# Altium project ThermoFlagger.PrjPcb
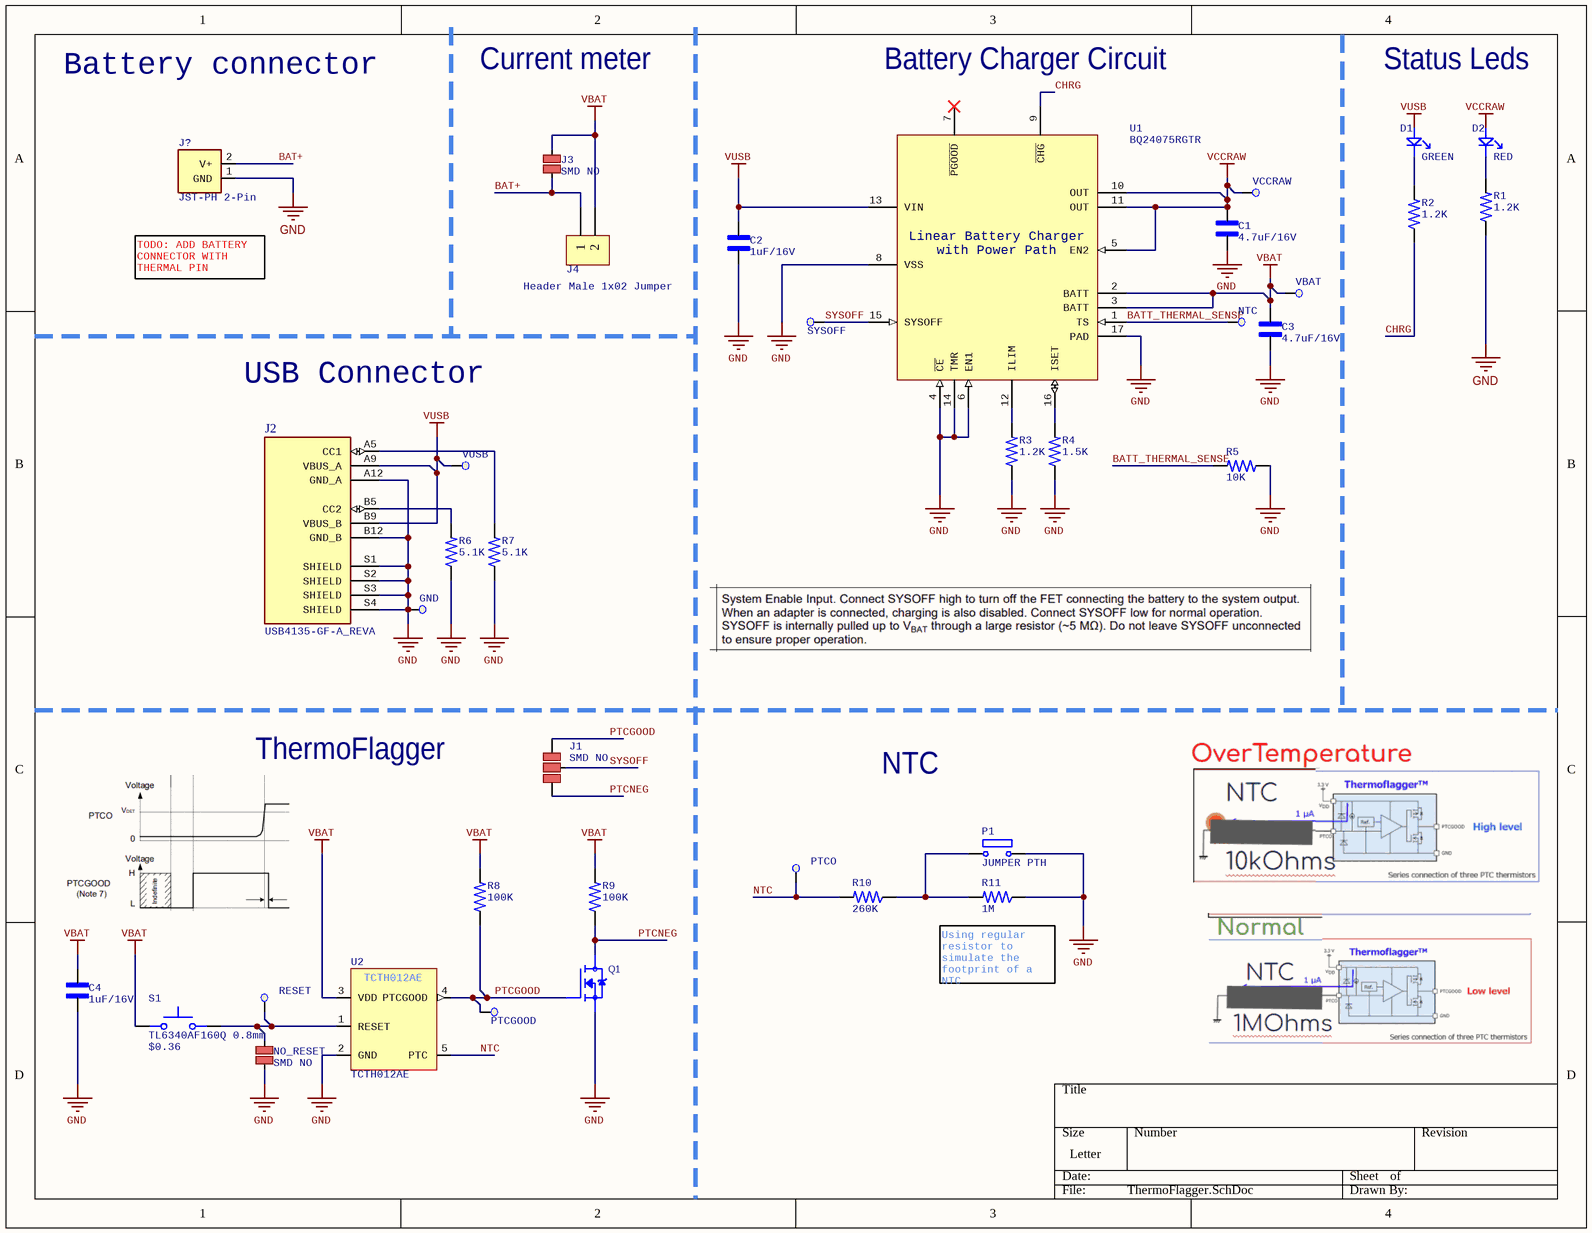
[diagram p0: ThermoFlagger.SchDoc]
1 sheet, 37 parts. Net scope: global (net labels, ports and power ports of the same name join across sheets).
Board file: ThermoFlagger.PcbDoc

## Sheet ThermoFlagger.SchDoc
size Letter; SheetNumber: 1; SheetTotal: 1

### Parts
C1  4.7uF/16V  [C0603]
C2  1uF/16V  [C0603]
C3  4.7uF/16V  [C0603]
C4  1uF/16V  [C0603]
D1  GREEN  [LED 0603]
D2  RED  [LED 0603]
GND  Test point 1.2mm  [TEST_POINT_1.2MM]  (value not drawn)  (no BOM)
J1  SMD NO  [JUMPER_SMD_NO_2WAY]  (net tie, no BOM)
J2  USB4135-GF-A_REVA  [GCT_USB4135 16-pin]
J3  SMD NO  [JUMPER_SMD_NO]  (net tie, no BOM)
J4  Header Male 1x02 Jumper  [Header 1x02 Jumper]
J?  JST-PH 2-Pin  [JST_B2B-PH-K-S(LF)(SN)]
NO_RESET  SMD NO  [JUMPER_SMD_NO]  (net tie, no BOM)
NTC  Test point 1.2mm  [TEST_POINT_1.2MM]  (value not drawn)  (no BOM)
P1  JUMPER PTH  [HDR1X2]  (no BOM)
PTCGOOD  Test point 1.2mm  [TEST_POINT_1.2MM]  (value not drawn)  (no BOM)
PTCO  Test point 1.2mm  [TEST_POINT_1.2MM]  (value not drawn)  (no BOM)
Q1  0.19A/1.1V  [SOT-23-3]  (value not drawn)
R1  1.2K  [R0603]
R2  1.2K  [R0603]
R3  1.2K  [R0603]
R4  1.5K  [R0603]
R5  10K  [R0603]
R6  5.1K  [R0603]
R7  5.1K  [R0603]
R8  100K  [R0603]
R9  100K  [R0603]
R10  260K  [R0603]
R11  1M  [R0603]
RESET  Test point 1.2mm  [TEST_POINT_1.2MM]  (value not drawn)  (no BOM)
S1  TL6340AF160Q 0.8mm  Parameter 1: $0.36  [TL6340AF160Q]
SYSOFF  Test point 1.2mm  [TEST_POINT_1.2MM]  (value not drawn)  (no BOM)
U1  BQ24075RGTR  [VQFN16]
U2  TCTH012AE  [SOT-553 (ESV)]
VBAT  Test point 1.2mm  [TEST_POINT_1.2MM]  (value not drawn)  (no BOM)
VCCRAW  Test point 1.2mm  [TEST_POINT_1.2MM]  (value not drawn)  (no BOM)
VUSB  Test point 1.2mm  [TEST_POINT_1.2MM]  (value not drawn)  (no BOM)

### Nets
GND: C1.2 C2.2 C3.2 C4.2 GND.1 J2.A12(GND_A) J2.B12(GND_B) J2.S1(SHIELD) J2.S2(SHIELD) J2.S3(SHIELD) J2.S4(SHIELD) J?.1(GND) NO_RESET.1 P1.2 Q1.2(S) R1.1 R3.1 R4.1 R5.1 R6.1 R7.1 R11.1 U1.4(~{CE}) U1.6(EN1) U1.8(VSS) U1.14(TMR) U1.17(PAD) U2.2(GND)
VBAT: C3.1 C4.1 J3.1 J4.2 R8.2 R9.2 S1.1 U1.2(BATT) U1.3(BATT) U2.3(VDD) VBAT.1
VCCRAW: C1.1 D2.1(A) U1.5(EN2) U1.10(OUT) U1.11(OUT) VCCRAW.1
VUSB: C2.1 D1.1(A) J2.A9(VBUS_A) J2.B9(VBUS_B) U1.13(VIN) VUSB.1
BAT+: J3.2 J4.1 J?.2(V+)
BATT_THERMAL_SENSE: NTC.1 R5.2 U1.1(TS)
CHRG: R2.1 U1.9(~{CHG})
NTC: PTCO.1 R10.2 U2.5(PTC)
PTCGOOD: J1.3 PTCGOOD.1 Q1.1(G) R8.1 U2.4(PTCGOOD)
PTCNEG: J1.1 Q1.3(D) R9.1
SYSOFF: J1.2 SYSOFF.1 U1.15(SYSOFF)
NetD1_2: D1.2(K) R2.2
NetD2_2: D2.2(K) R1.2
NetJ2_A5: J2.A5(CC1) R7.2
NetJ2_B5: J2.B5(CC2) R6.2
NetNO_RESET_2: NO_RESET.2 RESET.1 S1.2 U2.1(RESET)
NetP1_1: P1.1 R10.1 R11.2
NetR3_2: R3.2 U1.12(ILIM)
NetR4_2: R4.2 U1.16(ISET)

Not connected (* = marked no-connect by the designer): U1 7(~{PGOOD})*

### Notes on the sheet
- Battery connector
- Current meter
- Battery Charger Circuit
- Status Leds
- TODO: ADD BATTERY CONNECTOR WITH THERMAL PIN
- USB Connector
- ThermoFlagger
- NTC
- (near R11) Using regular resistor to simulate the footprint of a NTC
- (in symbol BQ24075RGTR) Linear Battery Charger; with Power Path

### Library data of the parts
C1 C3 = C0603 4.7uF/16V: 0603 4.7 uF 16 V ±10% Tolerance X5R Multilayer Ceramic Capacitor; Manufacturer: Murata; Manufacturer Part Number: GRT188R61C475KE13D; Value: 4.7uF; Voltage Rating: 16V; Supplier 1: Mouser; Supplier Part Number 1: 81-GRT188R61C475KE3D; RoHS: Yes; Category: Ceramic Capacitors; Stock 1: 39950; Pricing 1: 1=0.16, 10=0.066, 50=0.066, 100=0.038, 1000=0.034, 10000=0.029 (USD); Mounting Technology: Surface Mount; Case/Package: 0603; Case Code (Metric): 1608; Case Code (Imperial): 0603; Min Operating Temperature: -55°C; Max Operating Temperature: 85°C; Packaging: Cut Tape; Tolerance: 10%; Series: GRT; Length: 0.063inch; Width: 0.031inch; Thickness: 0.035inch; Ratings: AEC-Q200; RoHS Compliant: Yes
C2 C4 = C0603 1uF/16V X5R: MLCC 1uF 16V X5R 10% SMD 0603 85C Paper T/R; Manufacturer: Yageo; Manufacturer Part Number: CC0603KRX5R7BB105; Dissipation Factor: 7%; Supplier 1: Mouser; Supplier Part Number 1: 603-CC603KRX5R7BB105; RoHS: Yes; Category: Ceramic Capacitors; Stock 1: 726921; Pricing 1: 1=0.17000, 10=0.09100, 50=0.09100, 100=0.04100, 1000=0.03400, 10000=0.02100 (USD); Mount: Surface Mount; Case/Package: 0603; Number of Pins: 2; Case Code (Imperial): 0603; Case Code (Metric): 1608; Min Operating Temperature: -55°C; Max Operating Temperature: 85°C; Capacitance: 1uF; Tolerance: 10%; Dielectric: X5R; Voltage Rating: 16V; Voltage Rating (DC): 16V; Packaging: Tape and Reel; Package Quantity: 4000; Termination: SMD/SMT; Resistor Type: Ceramic; Series: CC; Construction: Flat; Length: 1.6mm; Width: 0.8mm; Height: 0.8mm; Thickness: 0.035inch; Depth: 0.8mm; Radiation Hardening: No; REACH SVHC: Unknown; Lead Free: Lead Free; Halogen Free: Halogen Free; RoHS Compliant: Yes
D1 = LED 0603 GREEN: Green 575nm LED Indication - Discrete 2V 0603; Manufacturer: Wurth Electronics; Manufacturer Part Number: 150060VS55040; Luminous Intensity: 60mcd; Lens Style: Flat; Viewing Angle: 140°; Dominant Wavelength: 573nm; Test Current: 20mA; Lens Transparency: Diffused; Lens Size: 0.8mm; Supplier 1: Mouser; Supplier Part Number 1: 710-150060VS55040; RoHS: No; Category: LEDs; Stock 1: 24940; Pricing 1: 1=0,18000, 10=0,16200, 50=0,16200, 100=0,14700, 1000=0,11700, 10000=0,11700 (USD); Mount: Surface Mount; Case/Package: 0603; Color: Green; Forward Voltage: 2V; Packaging: Cut Tape; Height: 0.5mm; Case Code (Imperial): 0603; Case Code (Metric): 1608; Length: 1.6mm; Width: 0.8mm
D2 = LED 0603 RED: Red 625nm LED Indication - Discrete 2V 0603; Manufacturer: Wurth Electronics; Manufacturer Part Number: 150060RS55040; Luminous Intensity: 90mcd; Viewing Angle: 140°; Lens Style: Flat; Dominant Wavelength: 624nm; Test Current: 20mA; Lens Transparency: Diffused; Lens Size: 0.8mm; Supplier 1: Mouser; Supplier Part Number 1: 710-150060RS55040; RoHS: No; Category: LEDs; Stock 1: 8586; Pricing 1: 1=0.18000, 10=0.16200, 100=0.14700, 500=0.13200, 1000=0.11700, 2000=0.11700 (USD); Mount: Surface Mount; Case/Package: 0603; Color: Red; Forward Voltage: 2V; Height: 0.5mm; Case Code (Imperial): 0603; Case Code (Metric): 1608; Packaging: Tape and Reel; Length: 1.6mm; Width: 0.8mm
GND NTC PTCGOOD PTCO RESET SYSOFF VBAT VCCRAW VUSB = Test point: SMD test point
J1 = JUMPER_SMD_NO_2WAY
J2 = USB4135-GF-A_REVA: Usb C Rec Gf Ra 6P SMT & SMT She; Manufacturer 1: Global Connector Technology; Supplier 1: Mouser; Supplier Part Number 1: 640-USB4135-GF-A; Manufacturer Part Number 1: USB4135-GF-A; RoHS: No; Category: Connectors; Stock 1: 1196; Pricing 1: 1=0.67300, 50=0.59700, 100=0.56000, 250=0.52200, 500=0.46600, 1000=0.43300, 1500=0.40000, 3000=0.33600 (USD)
J3 NO_RESET = JUMPER_SMD_NO: Rule: UNIONINDEX=0|RULEKIND=ShortCircuit|NETSCOPE=AnyNet|LAYERKIND=SameLayer|NAME=Schematic Short-Circuit Constraint|ALLOWED=TRUE|UNIT=Imperial
J4 = Header Male Jumper 1x02
J? = JST-PH 2-Pin: JST (JAPAN SOLDERLESS TERMINALS) - B2B-PH-K-S(LF)(SN) - Pin Header, Top Entry, Wire-to-Board, 2 mm, 1 Rows, 2 Contacts, Through Hole, PH Series; Supplier 1: LCSC; Supplier Part Number 1: C131337; Manufacturer: JST; Manufacturer Part Number: B2B-PH-K-S(LF)(SN); RoHS: Yes; Category: Connectors; Stock 1: 3352380; Pricing 1: 20=0.03960, 200=0.03310, 600=0.02840, 2000=0.02160, 10000=0.02100, 20000=0.02070 (USD); Weight: 0.0625lb; Length: 0.2inch; Width: 0.24inch; Height: 0.35inch
P1 = JUMPER PTH NO
Q1 = MOSFET N-CH NX7002AK,215: MOSFET Transistor, N Channel, 190 mA, 60 V, 3 ohm, 10 V, 1.6 V; Manufacturer: Nexperia; Supplier 1: Mouser; Supplier Part Number 1: 771-NX7002AK,215; Manufacturer Part Number: NX7002AK,215; RoHS: Yes; Category: MOSFETs; Stock 1: 451760; Pricing 1: 1=0.18, 10=0.131, 50=0.131, 100=0.059, 1000=0.036, 10000=0.021 (USD); RoHS Compliant: Yes; Supplier 2: LCSC; Supplier Part Number 2: C255584
R1-R3 = R0603 1.2K: RES 0603 1.2K OHM 1% 1/10W; Manufacturer: Yageo; Manufacturer Part Number: RC0603FR-071K2L; Power Rating: 100mW; Voltage Rating: 50V; Resistance: 1.2kR; Temperature Coefficient: 100ppm/°C; Supplier 1: Mouser; Supplier Part Number 1: 603-RC0603FR-071K2L; RoHS: Yes; Category: Chip SMD Resistors; Stock 1: 27884; Pricing 1: 1=0.10000, 10=0.02400, 50=0.02400, 100=0.01000, 1000=0.00400, 10000=0.00300 (USD); Case/Package: 0603; Number of Pins: 2; Case Code (Imperial): 0603; Case Code (Metric): 1608; Size Code: 0603; Min Operating Temperature: -55°C; Max Operating Temperature: 155°C; Tolerance: 1%; Voltage Rating (DC): 50V; Packaging: Tape and Reel; Termination: SMD/SMT; Resistor Type: Thick Film; Features: Moisture Resistant; Series: RC; Max Power Dissipation: 100mW; Number of Terminations: 2; Construction: Rectangular; Resistance Tolerance: 1%; Length: 1.6mm; Width: 0.8mm; Height: 0.45mm; Depth: 0.8mm; REACH SVHC: No SVHC; Military Standard: Not; Lead Free: Lead Free; RoHS Compliant: Yes; ComponentLink1URL: http://www.farnell.com/datasheets/443971.pdf?src-supplier=Farnell; ComponentLink1Description: http://www.farnell.com/datasheets/443971.pdf?src-supplier=Farnell; ComponentLink2URL: http://www.farnell.com/datasheets/1868787.pdf?src-supplier=Farnell; ComponentLink2Description: http://www.farnell.com/datasheets/1868787.pdf?src-supplier=Farnell; ComponentLink3URL: http://www.farnell.com/datasheets/2167052.pdf?src-supplier=Farnell; ComponentLink3Description: http://www.farnell.com/datasheets/2167052.pdf?src-supplier=Farnell; ComponentLink4URL: http://www.mouser.com/ds/2/447/RC0603-272842.pdf?src-supplier=Mouser; ComponentLink4Description: http://www.mouser.com/ds/2/447/RC0603-272842.pdf?src-supplier=Mouser; ComponentLink5URL: http://components.arrow.com/part/dataview/0323_00047720?src-supplier=Arrow+Europe; ComponentLink5Description: http://components.arrow.com/part/dataview/0323_00047720?src-supplier=Arrow+Europe; ComponentLink6URL: http://www.farnell.com/datasheets/443971.pdf?src-supplier=Element14; ComponentLink6Description: http://www.farnell.com/datasheets/443971.pdf?src-supplier=Element14; ComponentLink7URL: http://www.farnell.com/datasheets/2167052.pdf?src-supplier=Newark; ComponentLink7Description: http://www.farnell.com/datasheets/2167052.pdf?src-supplier=Newark; ComponentLink8URL: http://www.farnell.com/datasheets/1868787.pdf?src-supplier=Element14; ComponentLink8Description: http://www.farnell.com/datasheets/1868787.pdf?src-supplier=Element14; ComponentLink9URL: http://www.farnell.com/datasheets/2167052.pdf?src-supplier=Element14; ComponentLink9Description: http://www.farnell.com/datasheets/2167052.pdf?src-supplier=Element14; ComponentLink10URL: http://www.yageo.com/documents/recent/PYu-RC0603_51_RoHS_L_7.pdf?src-supplier=Future+Electronics; ComponentLink10Description: http://www.yageo.com/documents/recent/PYu-RC0603_51_RoHS_L_7.pdf?src-supplier=Future+Electronics; ComponentLink11URL: https://www.verical.com/server-webapp/html/getDatasheet?partID=326670&src-supplier=Verical; ComponentLink11Description: https://www.verical.com/server-webapp/html/getDatasheet?partID=326670&src-supplier=Verical; ComponentLink12URL: http://www.farnell.com/datasheets/1868787.pdf?src-supplier=Newark; ComponentLink12Description: http://www.farnell.com/datasheets/1868787.pdf?src-supplier=Newark; ComponentLink13URL: http://www.yageo.com/documents/recent/PYu-RC_Group_51_RoHS_L_9.pdf?src-supplier=Digi-Key; ComponentLink13Description: http://www.yageo.com/documents/recent/PYu-RC_Group_51_RoHS_L_9.pdf?src-supplier=Digi-Key; ComponentLink14URL: http://www.yageo.com/documents/recent/PYu-RC_Group_51_RoHS_L_10.pdf?src-supplier=Digi-Key; ComponentLink14Description: http://www.yageo.com/documents/recent/PYu-RC_Group_51_RoHS_L_10.pdf?src-supplier=Digi-Key
R4 = R0603 1.5K: RES 0603 1.5K OHM 0.5% 1/10W; Manufacturer: Yageo; Manufacturer Part Number: RC0603FR-071K5L; Tolerance: 1%; Resistance: 1.5kR; Temperature Coefficient: 100ppm/°C; Voltage Rating (DC): 50V; Power Rating: 100mW; Supplier 1: Mouser; Supplier Part Number 1: 603-RC0603FR-071K5L; RoHS: Yes; Category: Chip SMD Resistors; Stock 1: 312486; Pricing 1: 1=0.10000, 10=0.01800, 50=0.01800, 100=0.00600, 1000=0.00500, 10000=0.00300 (USD); Case/Package: 0603; Number of Pins: 2; Case Code (Metric): 1608; Case Code (Imperial): 0603; Min Operating Temperature: -55°C; Max Operating Temperature: 155°C; Packaging: Tape and Reel; Resistor Type: Thick Film; Voltage Rating: 50V; Package Quantity: 1; Number of Terminations: 2; Termination: SMD/SMT; Max Power Dissipation: 100mW; Features: Moisture Resistant; Length: 0.063inch; Width: 0.031inch; Height: 0.022inch; Depth: 0.8mm; REACH SVHC: No SVHC; Lead Free: Lead Free; Military Standard: Not
R5 = R0603 10K: SMD Chip Resistor, 10 kOhm, ± 1%, 100 mW, 0603 [1608 Metric], Thick Film, Anti-Sulfur; Manufacturer 1: Yageo; Manufacturer Part Number 1: AF0603FR-0710KL; Temperature Coefficient: 100ppm/°C; Power Rating: 100mW; Voltage Rating: 50V; Value: 10kR; Supplier 1: Mouser; Supplier Part Number 1: 603-AF0603FR-0710KL; RoHS: Yes; Category: Chip SMD Resistors; Case/Package: 0603; Case Code (Metric): 1608; Case Code (Imperial): 0603; Min Operating Temperature: -55°C; Max Operating Temperature: 155°C; Tolerance: 1%; Packaging: Tape and Reel; Package Quantity: 1; Number of Terminations: 2; Termination: SMD/SMT; Max Power Dissipation: 100mW; Features: Moisture Resistant,Anti-Sulfur; Length: 0.063inch; Width: 0.031inch; Height: 0.022inch; Lead Free: 5697LeadFree; Stock 3: 5000; Pricing 3: 5000=0.00223, 10000=0.00219, 20000=0.00213 (USD); Series: AF; RoHS Compliant: Yes; Supplier 2: Mouser; Supplier Part Number 2: 667-ERJ-3EKF1002V
R6 R7 = R0603 5.1K: RES 0603 5.1K OHM 1% 1/10W; Manufacturer: Yageo; Manufacturer Part Number: RC0603FR-075K1L; Power Rating: 100mW; Temperature Coefficient: 100ppm/°C; Resistance: 5.1kR; Voltage Rating: 50V; Supplier 1: Mouser; Supplier Part Number 1: 603-RC0603FR-075K1L; RoHS: Yes; Category: Chip SMD Resistors; Stock 1: 557916; Case/Package: 0603; Number of Pins: 2; Case Code (Imperial): 0603; Case Code (Metric): 1608; Min Operating Temperature: -55°C; Max Operating Temperature: 155°C; Tolerance: 1%; Packaging: Tape and Reel; Package Quantity: 1; Termination: SMD/SMT; Resistor Type: Thick Film; Number of Terminations: 2; Max Power Dissipation: 100mW; Voltage Rating (DC): 50V; Features: Moisture Resistant; Length: 0.063inch; Width: 0.031inch; Height: 0.022inch; Depth: 0.8mm; REACH SVHC: No SVHC; Military Standard: Not; Lead Free: Lead Free
R8 R9 = R0603 100K: RES 0603 100K OHM 1% 1/10W; Manufacturer 1: Yageo; Manufacturer Part Number 1: RC0603FR-07100KL; Power Rating: 100mW; Voltage Rating: 50V; Resistance: 100kR; Temperature Coefficient: 100ppm/°C; Working Voltage: 75V; Supplier 1: Mouser; Supplier Part Number 1: 603-RC0603FR-07100KL; RoHS: Yes; Category: Chip SMD Resistors; Stock 1: 4536807; Pricing 1: 1=0.10000, 10=0.02100, 100=0.00900, 1000=0.00400, 5000=0.00300, 10000=0.00200 (USD); Case/Package: 0603; Number of Pins: 2; Case Code (Imperial): 0603; Case Code (Metric): 1608; Min Operating Temperature: -55°C; Max Operating Temperature: 155°C; Tolerance: 1%; Voltage Rating (DC): 50V; Packaging: Tape and Reel; Termination: SMD/SMT; Resistor Type: Thick Film; Number of Terminations: 2; Length: 1.6mm; Width: 0.8mm; Height: 0.45mm; Depth: 0.8mm; REACH SVHC: No SVHC; Military Standard: Not; Lead Free: Lead Free
R10 = R0603 215K: RES 0603 215K OHM 1% 1/10W; Manufacturer 1: Yageo; Manufacturer Part Number 1: RC0603FR-07215KL; Power Rating: 100mW; Voltage Rating: 75V; Voltage Rating (DC): 50V; Resistance: 215kR; Temperature Coefficient: 100ppm/°C; Supplier 1: Mouser; Supplier Part Number 1: 603-RC0603FR-07215KL; RoHS: Yes; Category: Chip SMD Resistors; Stock 1: 61268; Pricing 1: 1=0,10000, 10=0,01800, 50=0,01800, 100=0,00700, 1000=0,00400, 10000=0,00200 (USD); Case/Package: 0603; Case Code (Imperial): 0603; Case Code (Metric): 1608; Min Operating Temperature: -55°C; Max Operating Temperature: 155°C; Tolerance: 1%; Packaging: Tape and Reel; Termination: SMD/SMT; Resistor Type: Thick Film; Number of Terminations: 2; Length: 1.6mm; Width: 0.031inch; Height: 0.022inch; Depth: 0.8mm; Military Standard: Not; Lead Free: Lead Free; Weight: 7.1E-05oz; Size Code: 0603; Series: RC; Package Quantity: 1; Max Power Dissipation: 100mW; Features: Moisture Resistant; Construction: Rectangular; RoHS Compliant: Yes; Supplier 2: Mouser; Supplier Part Number 2: 603-AC0603FR-07215KL
R11 = R0603 1M: RES 0603 1M OHM 1% 1/10W; Manufacturer 1: Yageo; Manufacturer Part Number 1: RC0603FR-071ML; Power Rating: 100mW; Voltage Rating: 75V; Voltage Rating (DC): 50V; Resistance: 1MR; Temperature Coefficient: 100ppm/°C; Application(s): HIGH RELIABILITY; Supplier 1: Mouser; Supplier Part Number 1: 603-RC0603FR-071ML; RoHS: Yes; Category: Chip SMD Resistors; Stock 1: 1321822; Pricing 1: 1=0.10000, 10=0.01800, 50=0.01800, 100=0.00700, 1000=0.00400, 10000=0.00200 (USD); Case/Package: 0603; Case Code (Imperial): 0603; Case Code (Metric): 1608; Min Operating Temperature: -55°C; Max Operating Temperature: 155°C; Tolerance: 1%; Packaging: Cut Tape; Termination: SMD/SMT; Resistor Type: Thick Film; Length: 1.6mm; Width: 0.8mm; Height: 0.45mm; Depth: 0.8mm; Military Standard: Not; Lead Free: Lead Free; Weight: 0.000847oz; Series: RC; Package Quantity: 5000; RoHS Compliant: Yes; Number of Pins: 2; Type: General Purpose; Technology: THICK FILM; REACH SVHC: No SVHC
S1 = TL6340AF160Q 0.8mm: TACTILE SWITCH, SPST, 0.02A/12VDC, SMD; Product Range: TL6340 Series; Actuator Orientation: Side Actuated; Switch...; Manufacturer: E-Switch; Supplier 1: Mouser; Supplier Part Number 1: 612-TL6340AF160QG; Manufacturer Part Number: TL6340AF160Q; RoHS: Yes; Category: Tactile Switches; Stock 1: 2636; Pricing 1: 1=0.51, 10=0.478, 50=0.478, 100=0.46, 1000=0.36, 10000=0.255 (USD); Supplier 2: LCSC; Supplier Part Number 2: C4944967
U1 = BQ24075RGTR: IC LI-ION CHARGE MGMT 16-QFN; Manufacturer: Texas Instruments; Output Voltage: 4.2V; Output Current: 1.5A; Min Supply Voltage: 4.35V; Max Supply Voltage: 6.4V; Min Input Voltage: 4.3V; Number of Cells: 1; Interface: USB; Fault Protection: Over Voltage,Over Temperature,Short Circuit,Reverse Current; Battery Chemistry: LITHIUM-ION; Supplier 1: Mouser; Supplier Part Number 1: 595-BQ24075RGTR; Manufacturer Part Number: BQ24075RGTR; RoHS: Yes; Category: Battery Management; Stock 1: 21933; Pricing 1: 1=2.52000, 10=2.27000, 50=2.14000, 100=1.82000, 1000=1.24000, 10000=1.24000 (USD); Case/Package: VQFN; Number of Pins: 16; Weight: 0.000808oz; Contact Plating: Gold; Min Operating Temperature: -40°C; Max Operating Temperature: 125°C; Packaging: Tape and Reel; Package Quantity: 3000; Series: -; Max Charge Current: 1.5A; Battery Pack Voltage: 4.2V; Radiation Hardening: No; Lead Free: Lead Free; RoHS Compliant: Yes; ComponentLink1URL: https://datasheet.ciiva.com/15114/getdatasheetpartid-471953-15114762.pdf?src-supplier=Verical; ComponentLink1Description: https://datasheet.ciiva.com/15114/getdatasheetpartid-471953-15114762.pdf?src-supplier=Verical; ComponentLink2URL: https://datasheet.ciiva.com/3214/bq24079-3214043.pdf?src-supplier=Avnet; ComponentLink2Description: https://datasheet.ciiva.com/3214/bq24079-3214043.pdf?src-supplier=Avnet; ComponentLink3URL: https://datasheet.ciiva.com/1934/bq24072-1934514.pdf?src-supplier=Digi-Key; ComponentLink3Description: https://datasheet.ciiva.com/1934/bq24072-1934514.pdf?src-supplier=Digi-Key; Supplier 2: Digi-Key; Supplier Part Number 2: 296-38874-1-ND; Supplier 3: Digi-Key; Supplier Part Number 3: 296-38874-2-ND; Supplier 4: Arrow Electronics; Supplier Part Number 4: BQ24075RGTR
U2 = TCTH012AE: Supervisory Circuits CMOS Linear IC Over Temp Detection IC IPTCO: 1uA Latching-func PTCGOOD: Push-Pull; Manufacturer 1: Toshiba; Manufacturer Part Number 1: TCTH012AE,LF(CT; Supplier 1: Mouser; RoHS: No; Stock 1: 8000; Pricing 1: 1=0.38, 10=0.296, 50=0.296, 100=0.265, 1000=0.201, 10000=0.154 (USD); Supplier Part Number 1: 757-TCTH012AELFCT